# EAGLE design main (EAGLE 6.4)

## Sheet 1 of 3
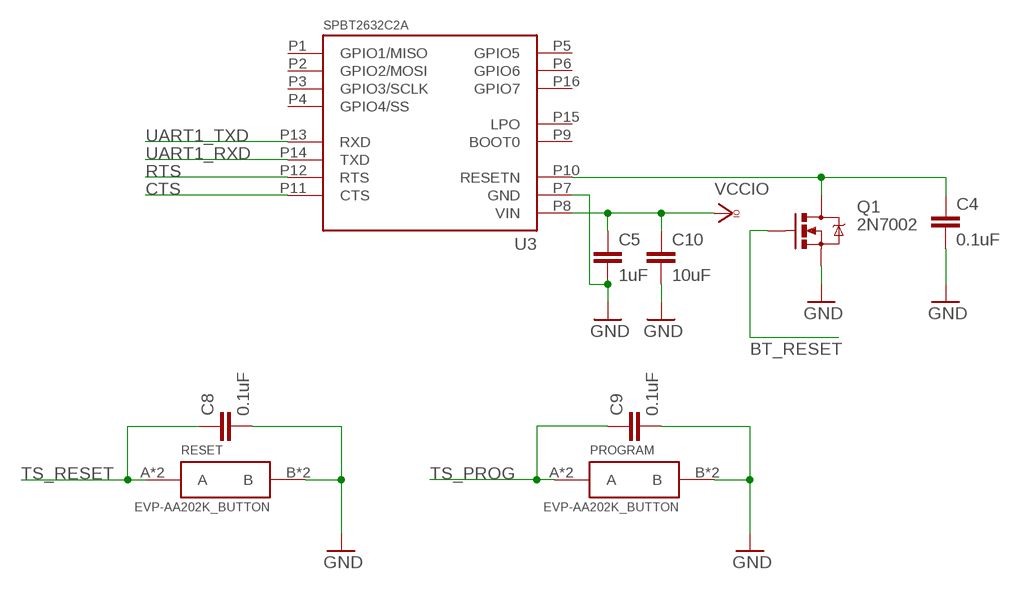
[diagram p0: schematic, sheet 1]

### Parts
C4  0.1uF  C-EUC0402  [C0402]
C5  1uF  C-EUC0402  [C0402]
C8  0.1uF  C-EUC0603  [C0603]
C9  0.1uF  C-EUC0603  [C0603]
C10  10uF  C-EUC0603  [C0603@1]
PROGRAM  EVP-AA202K_BUTTON  [EVP-AA202K_4PIN]
Q1  2N7002  MOSFET-NCHANNELSMD  [SOT23-3]
RESET  EVP-AA202K_BUTTON  [EVP-AA202K_4PIN]
U3  SPBT2632C2A  [SPBT2632C2A_16PIN_SMD]

### Nets
BT_RESET: Q1.1(G) ; also sheet 2
CTS: U3.P11(CTS) ; also sheet 2
GND: C4.2 C5.2 C8.2 C9.2 C10.2 PROGRAM.B PROGRAM.B'(B) Q1.2(S) RESET.B RESET.B'(B) U3.P7(GND) ; also sheet 2,3
N$7: C4.1 Q1.3(D) U3.P10(RESETN)
RTS: U3.P12(RTS) ; also sheet 2
TS_PROG: C9.1 PROGRAM.A PROGRAM.A'(A) ; also sheet 2
TS_RESET: C8.1 RESET.A RESET.A'(A) ; also sheet 2
UART1_RXD: U3.P14(TXD) ; also sheet 2
UART1_TXD: U3.P13(RXD) ; also sheet 2
VCCIO: C5.1 C10.1 U3.P8(VIN) ; also sheet 3
Unconnected: U3.P1(GPIO1/MISO) U3.P2(GPIO2/MOSI) U3.P3(GPIO3/SCLK) U3.P4(GPIO4/SS) U3.P5(GPIO5) U3.P6(GPIO6) U3.P9(BOOT0) U3.P15(LPO) U3.P16(GPIO7)

## Sheet 2 of 3
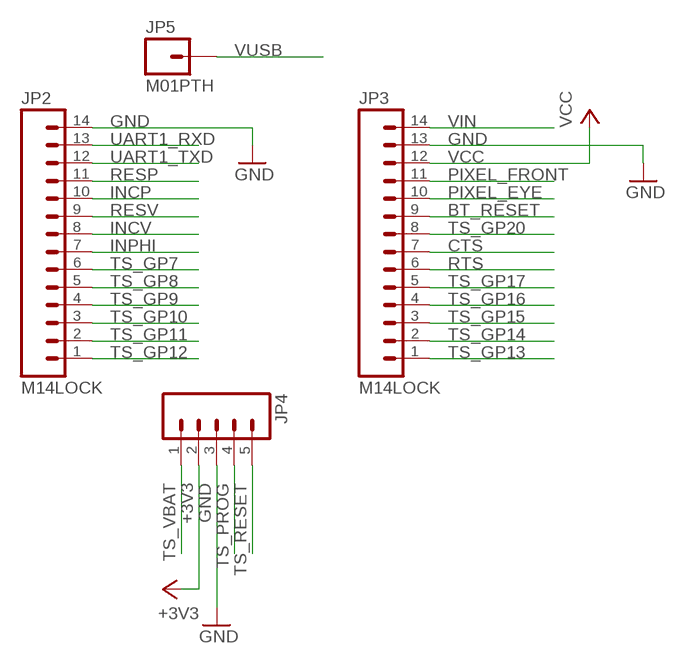
[diagram p1: schematic, sheet 2]

### Parts
JP2  M14LOCK  [1X14_LOCK]
JP3  M14LOCK  [1X14_LOCK]
JP4  M05LOCK  [1X05_LOCK]
JP5  M01PTH  [1X01]

### Nets
+3V3: JP4.2
BT_RESET: JP3.9 ; also sheet 1
CTS: JP3.7 ; also sheet 1
GND: JP2.14 JP3.13 JP4.3 ; also sheet 1,3
INCP: JP2.10
INCV: JP2.8
INPHI: JP2.7
PIXEL_EYE: JP3.10
PIXEL_FRONT: JP3.11
RESP: JP2.11
RESV: JP2.9
RTS: JP3.6 ; also sheet 1
TS_GP7: JP2.6
TS_GP8: JP2.5
TS_GP9: JP2.4
TS_GP10: JP2.3
TS_GP11: JP2.2
TS_GP12: JP2.1
TS_GP13: JP3.1
TS_GP14: JP3.2
TS_GP15: JP3.3
TS_GP16: JP3.4
TS_GP17: JP3.5
TS_GP20: JP3.8
TS_PROG: JP4.4 ; also sheet 1
TS_RESET: JP4.5 ; also sheet 1
TS_VBAT: JP4.1
UART1_RXD: JP2.13 ; also sheet 1
UART1_TXD: JP2.12 ; also sheet 1
VCC: JP3.12
VIN: JP3.14 ; also sheet 3
VUSB: JP5.1 ; also sheet 3

## Sheet 3 of 3
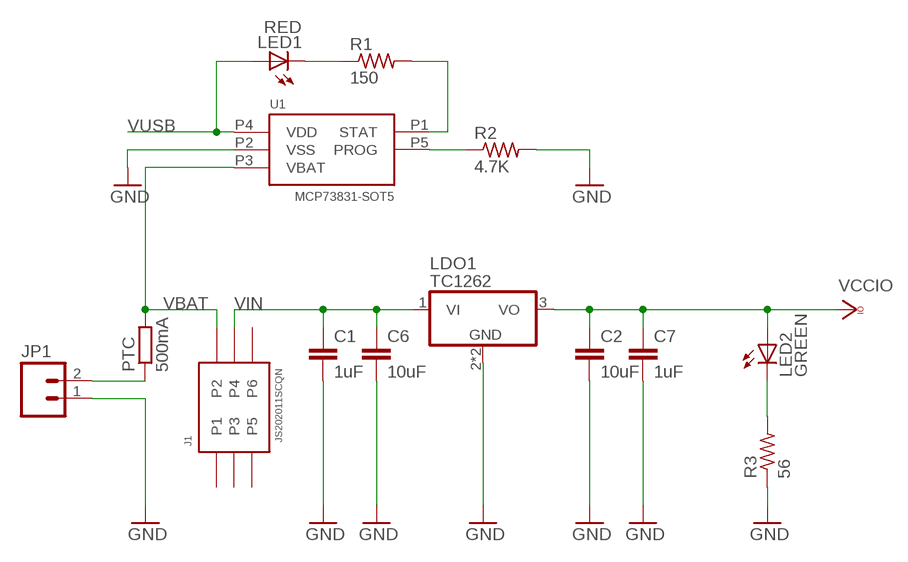
[diagram p2: schematic, sheet 3]

### Parts
C1  1uF  C-EUC0603  [C0603]
C2  10uF  C-EUC0603  [C0603]
C6  10uF  C-EUC0603  [C0603@1]
C7  1uF  C-EUC0603  [C0603@1]
J1  JS202011SCQN  [JS2020_6PIN_SMT]
JP1  M02-JST-2MM-SMT  [JST-2-SMD]
LDO1  TC1262  MCP1703DB  [SOT223]
LED1  RED  LEDCHIPLED_0603  [CHIPLED_0603]
LED2  GREEN  LEDCHIPLED_0603  [CHIPLED_0603]
PTC  500mA  R-EU_R0402  [R0402]
R1  150  R-US_R0402  [R0402]
R2  4.7K  R-US_R0402  [R0402]
R3  56  R-US_R0603  [R0603]
U1  MCP73831-SOT5  [SOT23-5]

### Nets
GND: C1.2 C2.2 C6.2 C7.2 JP1.1 LDO1.2(GND) LDO1.4(GND) R2.2 R3.1 U1.P2(VSS) ; also sheet 1,2
N$1: LED1.C R1.1
N$2: R1.2 U1.P1(STAT)
N$3: R2.1 U1.P5(PROG)
N$4: JP1.2 PTC.1
N$5: LED2.C R3.2
VBAT: J1.P2 PTC.2 U1.P3(VBAT)
VCCIO: C2.1 C7.1 LDO1.3(VO) LED2.A ; also sheet 1
VIN: C1.1 C6.1 J1.P4 LDO1.1(VI) ; also sheet 2
VUSB: LED1.A U1.P4(VDD) ; also sheet 2
Unconnected: J1.P1 J1.P3 J1.P5 J1.P6

## Library data of the parts
C1 C2 C8 C9 = rcl:C-EU: CAPACITOR, European symbol
C4-C7 C10 = resistor:C-EU: CAPACITOR, European symbol
J1 = glasses:JS202011SCQN
JP1 = SparkFun:M02: Header 2 Standard 2-pin 0.1" header. Use with straight break away headers (SKU : PRT-00116), right angle break away headers (PRT-00553), swiss pins (PRT-00743), machine pins (PRT-00117), and female headers (PRT-00115). Molex polarized connector foot print use with SKU : PRT-08233 with associated crimp pins and housings.
JP2 JP3 = SparkFun:M14: Header 14 Standard 14-pin 0.1" header. Use with straight break away headers (SKU : PRT-00116), right angle break away headers (PRT-00553), swiss pins (PRT-00743), machine pins (PRT-00117), and female headers (PRT-00115).
JP4 = SparkFun:M05: Header 5 Standard 5-pin 0.1" header. Use with straight break away headers (SKU : PRT-00116), right angle break away headers (PRT-00553), swiss pins (PRT-00743), machine pins (PRT-00117), and female headers (PRT-00115). Molex polarized connector foot print use with SKU : PRT-08230 with associated crimp pins and housings.
JP5 = SparkFun:M01: Header 1 Standard 1-pin 0.1" header. Use with straight break away headers (SKU : PRT-00116), right angle break away headers (PRT-00553), swiss pins (PRT-00743), machine pins (PRT-00117), and female headers (PRT-00115).
LDO1 = glasses:MCP1703: 250 mA, 16V, Low Quiescent Current LDO Regulator Source: http://ww1.microchip.com/downloads/en/DeviceDoc/22049b.pdf
LED1 LED2 = led:LED: LED OSRAM: - CHIPLED LG R971, LG N971, LY N971, LG Q971, LY Q971, LO R971, LY R971 LH N974, LH R974 LS Q976, LO Q976, LY Q976 LO Q996 - Hyper CHIPLED LW Q18S LB Q993, LB Q99A, LB R99A - SideLED LS A670, LO A670, LY A670, LG A670, LP A670 LB A673, LV A673, LT A673, LW A673 LH A674 LY A675 LS A676, LA A676, LO A676, LY A676, LW A676 LS A679, LY A679, LG A679 - Hyper Micro SIDELED® LS Y876, LA Y876, LO Y876, LY Y876 LT Y87S - SmartLED LW L88C, LW L88S LB L89C, LB L89S, LG L890 LS L89K, LO L89K, LY L89K LS L896, LA L896, LO L896, LY L896 - TOPLED LS T670, LO T670, LY T670, LG T670, LP T670 LSG T670, LSP T670, LSY T670, LOP T670, LYG T670 LG T671, LOG T671, LSG T671 LB T673, LV T673, LT T673, LW T673 LH T674 LS T676, LA T676, LO T676, LY T676, LB T676, LH T676, LSB T676, LW T676 LB T67C, LV T67C, LT T67C, LS T67K, LO T67K, LY T67K, LW E67C LS E67B, LA E67B, LO E67B, LY E67B, LB E67C, LV E67C, LT E67C LW T67C LS T679, LY T679, LG T679 LS T770, LO T770, LY T770, LG T770, LP T770 LB T773, LV T773, LT T773, LW T773 LH T774 LS E675, LA E675, LY E675, LS T675 LS T776, LA T776, LO T776, LY T776, LB T776 LHGB T686 LT T68C, LB T68C - Hyper Mini TOPLED® LB M676 - Mini TOPLED Santana® LG M470 LS M47K, LO M47K, LY M47K Source: http://www.osram.convergy.de LUXEON: - LUMILED® LXK2-PW12-R00, LXK2-PW12-S00, LXK2-PW14-U00, LXK2-PW14-V00 LXK2-PM12-R00, LXK2-PM12-S00, LXK2-PM14-U00 LXK2-PE12-Q00, LXK2-PE12-R00, LXK2-PE12-S00, LXK2-PE14-T00, LXK2-PE14-U00 LXK2-PB12-K00, LXK2-PB12-L00, LXK2-PB12-M00, LXK2-PB14-N00, LXK2-PB14-P00, LXK2-PB14-Q00 LXK2-PR12-L00, LXK2-PR12-M00, LXK2-PR14-Q00, LXK2-PR14-R00 LXK2-PD12-Q00, LXK2-PD12-R00, LXK2-PD12-S00 LXK2-PH12-R00, LXK2-PH12-S00 LXK2-PL12-P00, LXK2-PL12-Q00, LXK2-PL12-R00 Source: www.luxeon.com KINGBRIGHT: KA-3528ASYC Source: www.kingbright.com
PROGRAM RESET = glasses:EVP-AA202K_BUTTON
PTC = resistor:R-EU_: RESISTOR, European symbol
Q1 = SparkFun:MOSFET-NCHANNEL
R1 R2 = resistor:R-US_: RESISTOR, American symbol
R3 = rcl:R-US_: RESISTOR, American symbol
U1 = glasses:MCP73831-SOT5
U3 = senseye:SPBT2632C2A

## Board
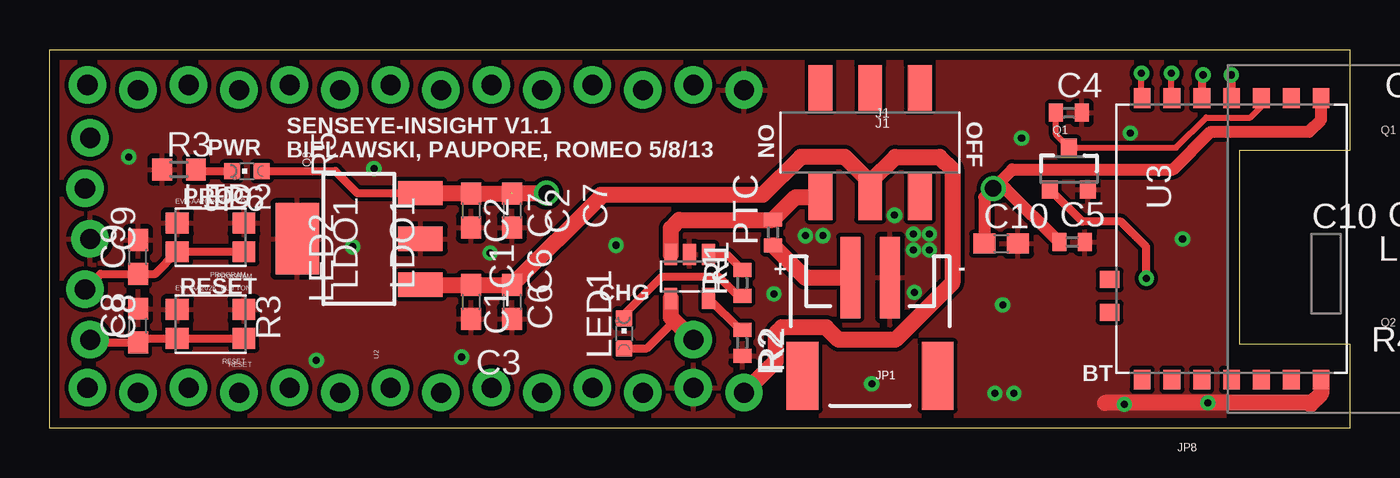
[diagram p3: board, top side]
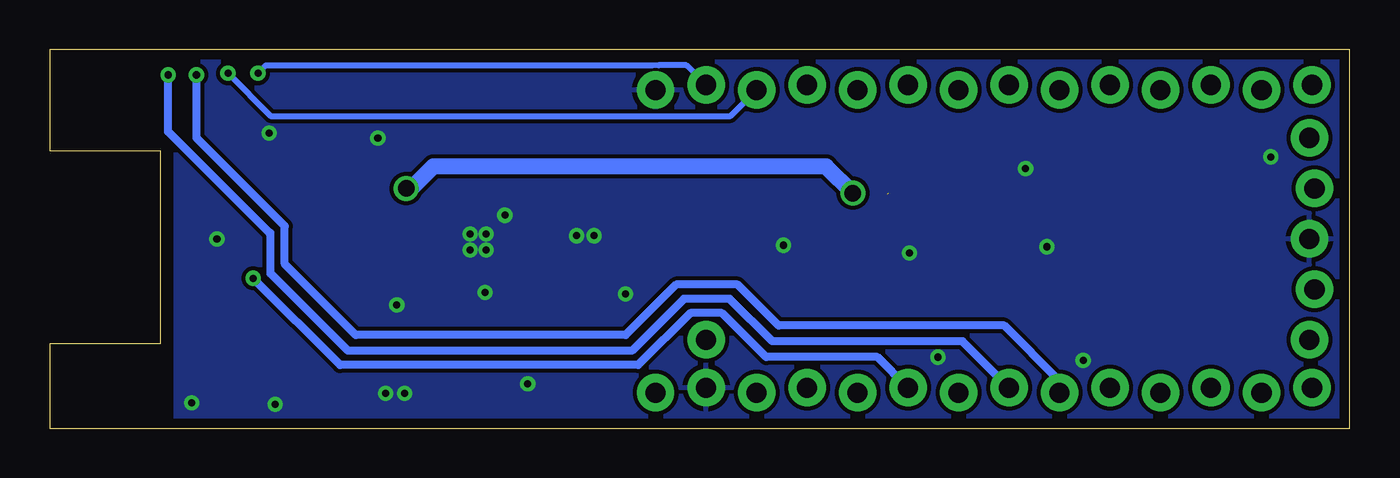
[diagram p4: board, bottom side, seen from below]

Size 65.41 x 19.05 mm. Coordinates in mm from the lower left corner, seen from the top.
Outline: 0,0 0,19.05 65.41,19.05 65.41,13.97 59.85,13.97 59.85,4.25 65.41,4.25 65.41,0 0,0
Copper layers (1*16): Top 0.0178mm / dielectric 59mil / Bottom 0.0178mm
Design rules "sunstone-2lyr_v1.0.0.3": minimum track width 6mil, minimum drill 14mil, track to track 6mil, track to pad 6mil, pad to pad 6mil, via to via 6mil, smd to smd 6mil, copper to edge 20mil, drill to drill 16mil, minimum pad ring 8mil, minimum via ring 8mil, stop-mask expansion 3mil, vias tented up to drill 0mil, thermal gap 10mil

### Footprints (pad centres in the part's own frame; a part is rotated, then mirrored left to right if it is on the bottom)
C0603 = smd 1.1 x 1: 1 -0.85,0; 2 0.85,0
C0402 = smd 0.7 x 0.9: 1 -0.65,0; 2 0.65,0
JS2020_6PIN_SMT = smd 1.2 x 2.3: P1 -2.5,1.25; P2 -2.5,-4.25; P3 0,1.25; P4 0,-4.25; P5 2.5,1.25; P6 2.5,-4.25
JST-2-SMD = smd 1 x 4.1: 1 -1,-3.45; 2 1,-3.45 | smd 1.6 x 3.4: NC1 -3.4,1.5; NC2 3.4,1.5
1X14_LOCK = drill 1.016 pad 1.88: 1 0,0.127; 2 2.54,-0.127; 3 5.08,0.127; 4 7.62,-0.127; 5 10.16,0.127; 6 12.7,-0.127; 7 15.24,0.127; 8 17.78,-0.127; 9 20.32,0.127; 10 22.86,-0.127; 11 25.4,0.127; 12 27.94,-0.127; 13 30.48,0.127; 14 33.02,-0.127
1X05_LOCK = drill 1.016 pad 1.88: 1 0,0.127; 2 2.54,-0.127; 3 5.08,0.127; 4 7.62,-0.127; 5 10.16,0.127
1X01 = drill 1.016 pad 1.88: 1 0,0
SOT223 = smd 1.219 x 2.235: 1 -2.311,-3.099; 2 0,-3.099; 3 2.311,-3.099 | smd 3.6 x 2.2: 4 0,3.099
CHIPLED_0603 = smd 0.8 x 0.8: A 0,-0.75; C 0,0.75
EVP-AA202K_4PIN = smd 1.15 x 1.05: A -1.675,0.725; A' 1.675,0.725; B -1.675,-0.725; B' 1.675,-0.725
R0402 = smd 0.7 x 0.9: 1 -0.65,0; 2 0.65,0
SOT23-3 = smd 0.8 x 0.9: 1 -0.95,-1; 2 0.95,-1; 3 0,1.1
R0603 = smd 1 x 1.1: 1 -0.85,0; 2 0.85,0
SOT23-5 = smd 1.06 x 0.65: P1 -0.35,0.95; P2 -0.35,0; P3 -0.35,-0.95; P4 1.85,-0.95; P5 1.85,0.95
SPBT2632C2A_16PIN_SMD = smd 1 x 0.85: P1 -7.085,-1.3; P2 -7.085,-2.8; P3 -7.085,-4.3; P4 -7.085,-5.8; P5 -7.085,-7.3; P6 -7.085,-8.8; P7 -7.085,-10.3; P8 7.085,-10.3; P9 7.085,-8.8; P10 7.085,-7.3; P11 7.085,-5.8; P12 7.085,-4.3; P13 7.085,-2.8; P14 7.085,-1.3 | smd 0.85 x 1: P15 -2.05,0.335; P16 -3.7,0.335

### Placement (x,y rotation side)
C1  21.19,6.35 270 top
C2  21.19,10.95 270 top
C4  51.28,15.88 0 top
C5  51.44,9.37 0 top
C6  10uF  [C0603]  23.26,6.35 270 top
C7  1uF  [C0603]  23.26,10.95 270 top
C8  4.45,5.16 90 top
C9  4.45,8.62 90 top
C10  10uF  [C0603]  47.86,9.29 0 top
J1  41.27,15.88 0 top
JP1  41.27,4.13 180 top
JP2  1.91,17.14 0 top
JP3  1.91,1.91 0 top
JP4  1.91,14.61 270 top
JP5  32.38,4.45 0 top
LDO1  15.56,9.53 90 top
LED1  28.89,4.76 0 top
LED2  9.92,12.94 90 top
PROGRAM  8.1,9.6 180 top
PTC  36.39,9.84 90 top
Q1  51.28,13.02 0 top
R1  34.85,7.3 90 top
R2  34.85,4.29 270 top
R3  6.51,13.02 0 top
RESET  8.1,5.24 180 top
U1  32.19,8.38 270 top
U3  53.66,9.53 90 top

### Tracks (layer width: path | path; a pad name or v marks a point on that pad's centre or on a via)
BT_RESET  (via drill 0.36)
  Top 0.305: Q1.1
  Top 0.406: v55.17,7.54 55.17,9.13 53.9,10.4 51.95,10.4 Q1.1
  Bottom 0.406: JP3.9 23.77,3.57 29.37,3.57 31.59,5.79 33.18,5.79 35.8,3.17 50.8,3.17 v55.17,7.54
CTS  (via drill 0.36)
  Top 0.406: v59.45,17.78 U3.P11
  Bottom 0.406: JP3.7 19.48,4.37 29.05,4.37 31.19,6.51 33.5,6.51 36.12,3.89 50.4,3.89 54.29,7.78 54.29,9.84 54.37,9.84 59.45,14.92 v59.45,17.78
GND  (via drill 0.36)
  Top 0.813: U3.P7 63.96,1.73 63.42,1.19 63.34,1.27 53.1,1.27
  other vias: 43.5,6.83 22.15,8.81 36.43,6.75 15.24,9.13 3.97,13.65 38.89,9.68 54.37,14.84 13.41,3.41 41.35,2.22 48.9,14.61 43.46,9.76 44.25,9.76 43.46,8.97 44.25,8.97 42.51,10.72 16.31,13.06 58.26,1.27 38.02,9.68 20.72,3.57 47.55,1.75 47.94,6.19 56.99,9.53 48.5,1.75 54.05,1.19 28.49,9.2
  pour Bottom (isolate 0.203): 0,0 0,19.05 59.05,19.05 59.05,0
  pour Top (isolate 0.203, rank 6): 0,0 0,19.05 59.05,19.05 59.05,0
N$1
  Top 0.406: LED1.C 28.89,5.71 30.8,7.62 33.66,7.62 34.62,6.65 R1.1
N$2
  Top 0.406: R1.2 34.07,8.73 U1.P1
N$3
  Top 0.406: U1.P5 34.74,4.94 R2.1
N$4
  Top 0.813: PTC.1 38,7.58 JP1.2
N$5
  Top 0.406: R3.2 7.44,12.94 LED2.C
N$7
  Top 0.305: C4.1 50.63,14.77 Q1.3 56.66,14.12 58.18,15.64 60.4,15.64 60.96,16.19 U3.P10
RTS  (via drill 0.36)
  Top 0.406: v58.02,17.78 57.96,17.71 U3.P12
  Bottom 0.406: JP3.6 14.61,2.38 17.38,5.16 28.73,5.16 30.8,7.22 33.89,7.22 36.43,4.68 50.01,4.68 53.58,8.26 53.58,10.16 58.02,14.61 v58.02,17.78
TS_PROG
  Top 0.406: JP4.4 2.56,7.77 C9.1 5.31,7.77 PROGRAM.A' PROGRAM.A
TS_RESET
  Top 0.406: RESET.A' RESET.A | 4.31,4.45 C8.1 | 6.22,4.31 RESET.A' | JP4.5 2.17,4.31 C8.1 | C8.1 4.65,4.51 RESET.A'
UART1_RXD  (via drill 0.36)
  Top 0.305: U3.P14 54.93,16.64 v54.93,17.86
  Bottom 0.279: 34.77,18.26 35.08,18.26
  Bottom 0.305: JP2.13 33.37,18.26 34.77,18.26 | v54.93,17.86 54.53,18.26 35.08,18.26
UART1_TXD  (via drill 0.36)
  Top 0.305: U3.P13 56.52,16.67 56.44,16.75 v56.44,17.86
  Bottom 0.305: JP2.12 31.15,15.72 54.29,15.72 v56.44,17.86
VBAT
  Top 0.813: U1.P3 31.24,10.05 31.67,10.48 36.37,10.48 PTC.2 37.52,11.62 J1.P2
VCCIO  (via drill 0.84)  (1 unrouted)
  Top 0.305: 50.84,9.31 C5.1
  Top 0.406: LED2.A 14.37,12.94 15.48,11.83 18.65,11.83 LDO1.3
  Top 0.61: v47.47,12.06 48.42,13.02 56.52,13.02 58.42,14.92 63.34,14.92 63.96,15.54 U3.P8 | v47.47,12.06 48.09,12.06 C5.1 | v47.47,12.06 47.01,11.61 C10.1
  Top 0.813: LDO1.3 21.16,11.84 C2.1 C7.1 | 23.2,11.83 v25,11.83
  Bottom 0.813: v25,11.83 26.35,13.18 46.12,13.18 47.23,12.06 v47.47,12.06
VIN
  Top 0.813: J1.P4 41.27,12.38 | 41.27,12.38 42.55,13.65 44.77,13.65 45.4,13.02 45.4,7.3 42.55,4.45 39.69,4.45 39.05,5.08 36.83,5.08 36.51,4.76 36.51,3.37 JP3.14 | 41.27,12.38 40.01,13.65 37.78,13.65 35.88,11.75 27.73,11.75 27.73,11.67 C6.1 C1.1 21.18,7.21 LDO1.1
VUSB
  Top 0.406: LED1.A 30.05,4.01 31.43,5.4
  Top 0.813: JP5.1 31.43,5.4 31.24,5.58 U1.P4

### Text on the board
tPlace: SENSEYE-INSIGHT V1.1 / BIELAWSKI, PAUPORE, ROMEO 5/8/13 | PWR | ON | OFF | PROG | + | - | RESET | CHG | BT
_tNames: C4 | J1 | R5 | Q1 | Q3 | JP6 | C2 | C7 | LED2 | U3 | C10 | C5 | C9 | PTC | PROGRAM | LED3 | LDO1 | C1 | C6 | R1 | R2 | Q2 | R4 | C8 | R3 | C3 | RESET | U2 | LED1 | JP1 | JP8